# Altium project Optical indication.PrjPcb
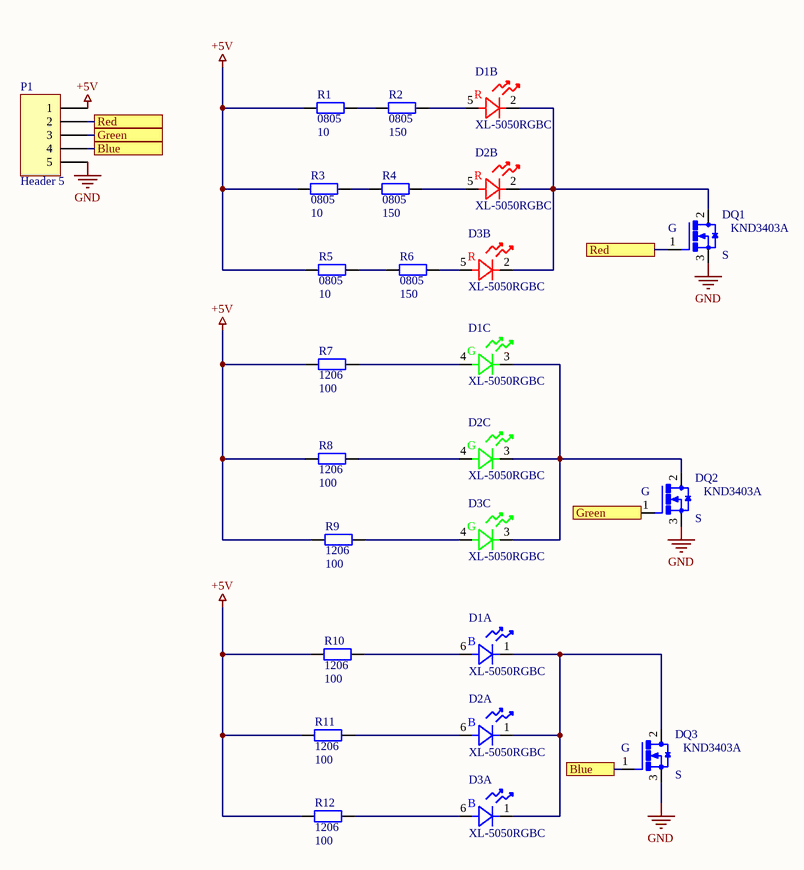
[diagram p0: Optical indication.SchDoc]
1 sheet, 19 parts. Net scope: flat (ports and power ports of the same name join across sheets).
Board file: Optical indication .PcbDoc

## Sheet Optical indication.SchDoc
size A4 portrait; SheetNumber: 1; SheetTotal: 1

### Parts
D1  XL-5050RGBC  [XL-5050RGBC]  (parts A,B,C of 3)
D2  XL-5050RGBC  [XL-5050RGBC]  (parts A,B,C of 3)
D3  XL-5050RGBC  [XL-5050RGBC]  (parts A,B,C of 3)
P1  Header 5  [HDR1X5]
Q1  KND3403A  [TO252]
Q2  KND3403A  [TO252]
Q3  KND3403A  [TO252]
R1  0805  value 10  [AXIAL-0.4]
R2  0805  value 150  [AXIAL-0.4]
R3  0805  value 10  [AXIAL-0.4]
R4  0805  value 150  [AXIAL-0.4]
R5  0805  value 10  [AXIAL-0.4]
R6  0805  value 150  [AXIAL-0.4]
R7  1206  value 100  [AXIAL-0.4]
R8  1206  value 100  [AXIAL-0.4]
R9  1206  value 100  [AXIAL-0.4]
R10  1206  value 100  [AXIAL-0.4]
R11  1206  value 100  [AXIAL-0.4]
R12  1206  value 100  [AXIAL-0.4]

### Ports
Blue, Green, Red

### Nets
+5V: P1.1 R1.2 R3.2 R5.2 R7.2 R8.2 R9.2 R10.2 R11.2 R12.2
GND: P1.5 Q1.3(S) Q2.3(S) Q3.3(S)
NetD1_1: D1.1 D2.1 D3.1 Q3.2(D)
NetD1_2: D1.2 D2.2 D3.2 Q1.2(D)
NetD1_3: D1.3 D2.3 D3.3 Q2.2(D)
NetD1_4: D1.4 R7.1
NetD1_5: D1.5 R2.2
NetD1_6: D1.6 R10.1
NetD2_4: D2.4 R8.1
NetD2_5: D2.5 R4.2
NetD2_6: D2.6 R11.1
NetD3_4: D3.4 R9.1
NetD3_5: D3.5 R6.1
NetD3_6: D3.6 R12.1
NetP1_2: P1.2 Q1.1(G) ; port Red
NetP1_3: P1.3 Q2.1(G) ; port Green
NetP1_4: P1.4 Q3.1(G) ; port Blue
NetR1_1: R1.1 R2.1
NetR3_1: R3.1 R4.1
NetR5_1: R5.1 R6.2

### Notes on the sheet
- REVISION
- DESCRIPTION
- DATE
- APPROVED
- Signature
- Date
- This document is the property of ©Innovation and design Technolgies, I-Dtech
- Reproduction or use without written consent is strictly forbiden
- Design
- Review
- Description:
- Project Name:
- Approve
- Size:
- Sheet:
- Schematic No.:
- Rev.:
- (in symbol XL-5050RGBC, part A) B
- (in symbol XL-5050RGBC, part B) R
- (in symbol XL-5050RGBC, part C) G

### Library data of the parts
P1 = Header 5: Header, 5-Pin; LatestRevisionDate: 17-Jul-2002; LatestRevisionNote: Re-released for DXP Platform.; Publisher: Altium Limited
Q1-Q3 = KND3403A: N-CHANNEL MOSFET
R1-R12 = Res2: Resistor; Published: 8-Jun-2000; LatestRevisionDate: 17-Jul-2002; LatestRevisionNote: Re-released for DXP Platform.; PackageReference: AXIAL-0.4; Publisher: Altium Limited; PackageDescription: Axial Device, Thru-Hole; 2 Leads; 0.4 in Pin Spacing